# Altium schematic sheet Sheet2.SchDoc
size 300 x 200 mm; SheetNumber: 1; SheetTotal: 2
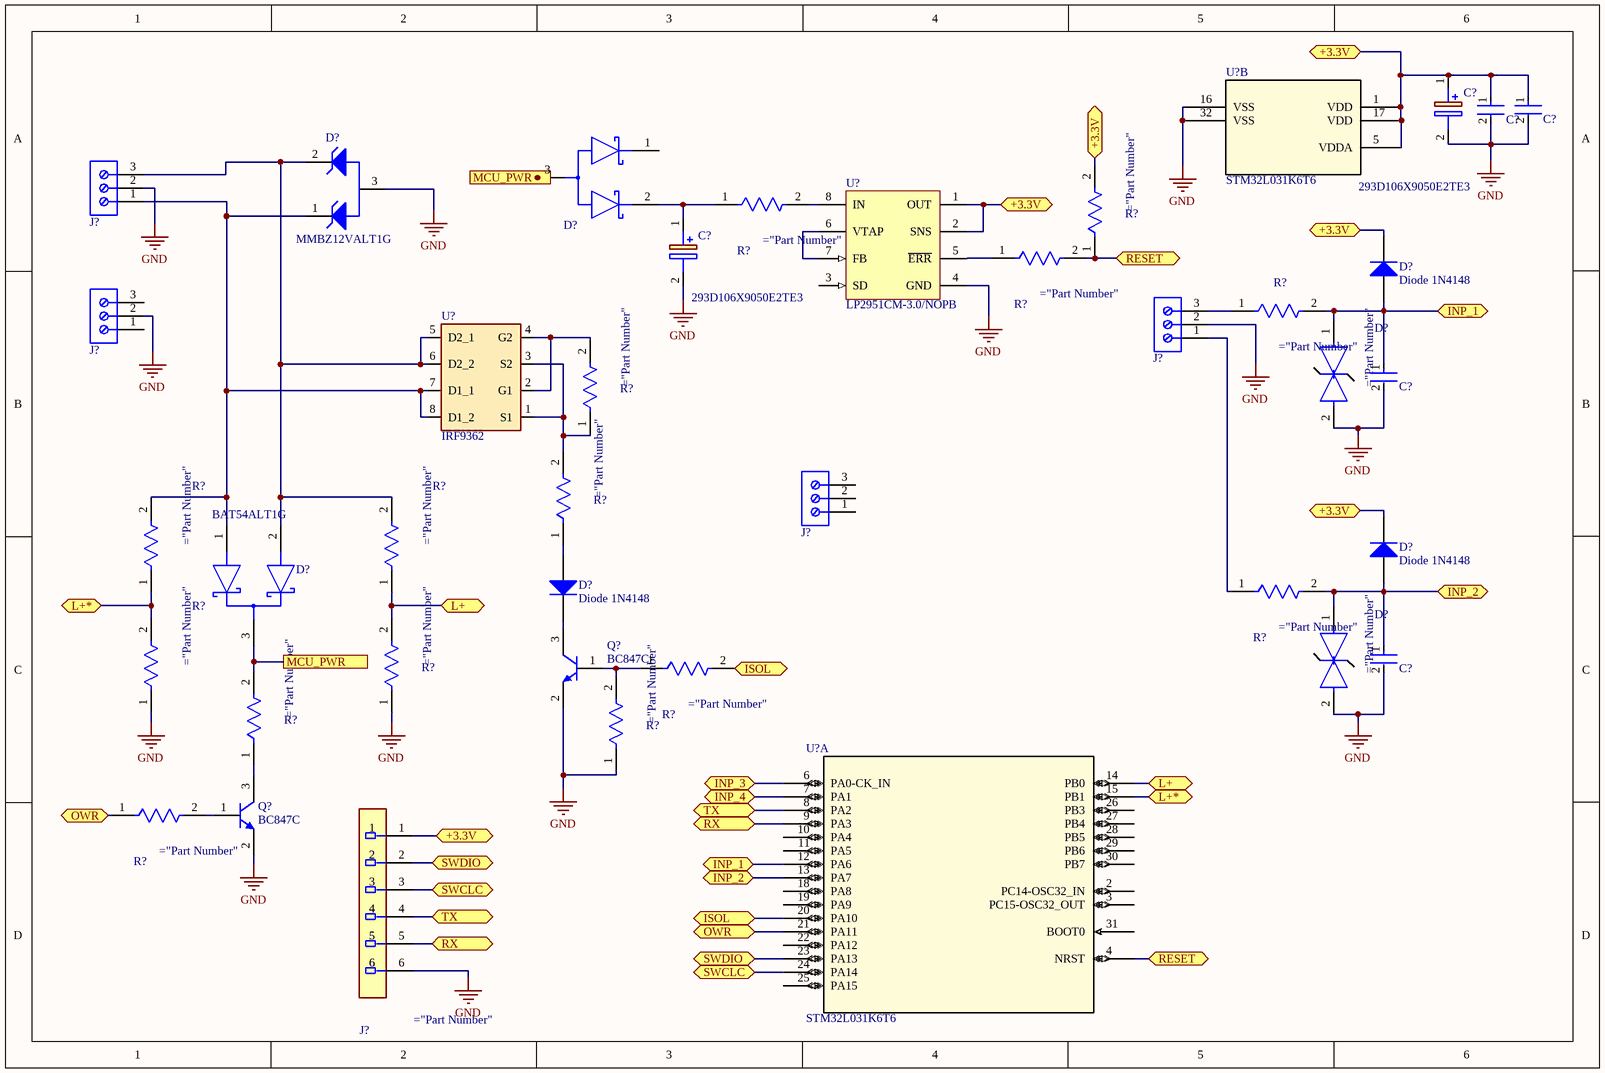
[diagram p0: Sheet2.SchDoc]

## Parts
(Parts that share a designator on the sheet are numbered #1, #2 ... from top to bottom, then left to right.)
C?#1  293D106X9050E2TE3  [CAPPM7343X430N]
C?#2  C0805C224K5RACTU  [KEMET_C0805C-DN_IPC_B]  (value not drawn)
C?#3  C0805C224K5RACTU  [KEMET_C0805C-DN_IPC_B]  (value not drawn)
C?#4  293D106X9050E2TE3  [CAPPM7343X430N]
C?#5  C0805C224K5RACTU  [KEMET_C0805C-DN_IPC_B]  (value not drawn)
C?#6  C0805C224K5RACTU  [KEMET_C0805C-DN_IPC_B]  (value not drawn)
D?#1  BAT54ALT1G  [INF-SOT23_L]  (value not drawn)
D?#2  MMBZ12VALT1G  [ONSC-SOT-23-3-318-08_V]
D?#3  Diode 1N4148  [Vishay_S8-V-3910_01-001_IPC_B]
D?#4  PESD5Z3.3,115  [Nexperia_USA_Inc._SOD523_0]  (value not drawn)
D?#5  Diode 1N4148  [Vishay_S8-V-3910_01-001_IPC_B]
D?#6  Diode 1N4148  [Vishay_S8-V-3910_01-001_IPC_B]
D?#7  BAT54ALT1G  [INF-SOT23_L]
D?#8  PESD5Z3.3,115  [Nexperia_USA_Inc._SOD523_0]  (value not drawn)
J?#1  691103110003  [691103110003]  (value not drawn)
J?#2  691103110003  [691103110003]  (value not drawn)
J?#3  691103110003  [691103110003]  (value not drawn)
J?#4  691103110003  [691103110003]  (value not drawn)
J?#5  SWR25X-NRTC-S06-ST-BA  [Sullins_SWR25X-NRTC-S06-ST-BA_MFG]  (value not drawn)
Q?#1  BC847C  [INF-SOT23_N]
Q?#2  BC847C  [INF-SOT23_N]
R?#1  RC0805FR-07100KL  [6-0805_L]  (value not drawn)
R?#2  RC0805FR-07100KL  [6-0805_N]  (value not drawn)
R?#3  RC0805FR-07100KL  [6-0805_L]  (value not drawn)
R?#4  RC0805FR-07100KL  [6-0805_M]  (value not drawn)
R?#5  RC0805FR-07100KL  [6-0805_N]  (value not drawn)
R?#6  RC0805FR-07100KL  [6-0805_N]  (value not drawn)
R?#7  RC0805FR-07100KL  (value not drawn)
R?#8  RC0805FR-07100KL  (value not drawn)
R?#9  RC0805FR-07100KL  [6-0805_M]  (value not drawn)
R?#10  RC0805FR-07100KL  (value not drawn)
R?#11  RC0805FR-07100KL  (value not drawn)
R?#12  RC0805FR-07100KL  [6-0805_M]  (value not drawn)
R?#13  RC0805FR-07100KL  (value not drawn)
R?#14  RC0805FR-07100KL  [6-0805_N]  (value not drawn)
R?#15  RC0805FR-07100KL  [6-0805_N]  (value not drawn)
U?#1  STM32L031K6T6  [LQFP32_7X7X1P4]  (part B of 2)
U?#2  LP2951CM-3.0/NOPB  [SOIC127P600X175-8N]
U?#3  IRF9362  [M08A_L]
U?#4  STM32L031K6T6  [LQFP32_7X7X1P4]  (part A of 2)

## Ports
+3.3V (bidir), INP_1 (bidir), INP_2 (bidir), INP_3 (bidir), INP_4 (bidir), ISOL (bidir), L+ (bidir), L+* (bidir), MCU_PWR, OWR (bidir), RESET (bidir), RX (bidir), SWCLC (bidir), SWDIO (bidir), TX (bidir)

## Nets
GND: C?#1.2(-) C?#2.2 C?#3.2 C?#4.2(-) C?#5.2 C?#6.2 D?#2.3(A) D?#4.2(A) D?#8.2(A) J?#1.2 J?#2.2 J?#3.2 J?#5.6 Q?#1.2(E) Q?#2.2(E) R?#10.1 R?#11.1 R?#14.1 U?#1.16(VSS) U?#1.32(VSS) U?#2.4(GND)
+3.3V: C?#1.1(+) C?#2.1 C?#3.1 D?#3.2(K) D?#5.2(K) J?#5.1 R?#2.2 U?#1.1(VDD) U?#1.5(VDDA) U?#1.17(VDD) U?#2.1(OUT) U?#2.2(SNS) ; port +3.3V
INP_1: C?#5.1 D?#3.1(A) D?#4.1(C) R?#4.2 U?#4.12(PA6) ; port INP_1
INP_2: C?#6.1 D?#5.1(A) D?#8.1(C) R?#9.2 U?#4.13(PA7) ; port INP_2
INP_3: U?#4.6(PA0-CK_IN) ; port INP_3
INP_4: U?#4.7(PA1) ; port INP_4
ISOL: R?#12.2 U?#4.20(PA10) ; port ISOL
L+: R?#8.1 R?#11.2 U?#4.14(PB0) ; port L+
L+*: R?#7.1 R?#10.2 U?#4.15(PB1) ; port L+*
MCU_PWR: D?#7.3(CATHODE) R?#13.2 ; port MCU_PWR
OWR: R?#15.1 U?#4.21(PA11) ; port OWR
RESET: R?#2.1 R?#3.2 U?#4.4(NRST) ; port RESET
RX: J?#5.5 U?#4.9(PA3) ; port RX
SWCLC: J?#5.3 U?#4.24(PA14) ; port SWCLC
SWDIO: J?#5.2 U?#4.23(PA13) ; port SWDIO
TX: J?#5.4 U?#4.8(PA2) ; port TX
NetC?#4_1: C?#4.1(+) D?#1.2(2_CATHODE) R?#1.1
NetD?#2_1: D?#2.1(K1) D?#7.1(1_ANODE) J?#1.1 R?#7.2 U?#3.7(D1_1) U?#3.8(D1_2)
NetD?#2_2: D?#2.2(K2) D?#7.2(2_ANODE) J?#1.3 R?#8.2 U?#3.5(D2_1) U?#3.6(D2_2)
NetD?#6_1: D?#6.1(A) R?#6.1
NetD?#6_2: D?#6.2(K) Q?#1.3(C)
NetJ?#3_1: J?#3.1 R?#9.1
NetJ?#3_3: J?#3.3 R?#4.1
NetQ?#1_1: Q?#1.1(B) R?#12.1 R?#14.2
NetQ?#2_1: Q?#2.1(B) R?#15.2
NetQ?#2_3: Q?#2.3(C) R?#13.1
NetR?#1_2: R?#1.2 U?#2.8(IN)
NetR?#3_1: R?#3.1 U?#2.5(~{ERR})
NetR?#5_1: R?#5.1 R?#6.2 U?#3.1(S1) U?#3.3(S2)
NetR?#5_2: R?#5.2 U?#3.2(G1) U?#3.4(G2)
NetU?#2_6: U?#2.6(VTAP) U?#2.7(FB)

Not connected (* = marked no-connect by the designer): D?#1 1(1_CATHODE) 3(A); J?#2 1 3; J?#4 1 2 3; U?#2 3(SD); U?#4 2(PC14-OSC32_IN) 3(PC15-OSC32_OUT) 10(PA4) 11(PA5) 18(PA8) 19(PA9) 22(PA12) 25(PA15) 26(PB3) 27(PB4) 28(PB5) 29(PB6) 30(PB7) 31(BOOT0)

## Library data of the parts
C?#1 C?#4 = 293D106X9050E2TE3: Capacitor Polarised; Manufacturer_Name: Vishay; Datasheet Link: http://www.vishay.com/doc?40002; Height: 4.3mm; Manufacturer_Part_Number: 293D106X9050E2TE3; Mouser Part Number: 74-293D106X9050E2TE3; Mouser Price/Stock: https://www.mouser.com/Search/Refine.aspx?Keyword=74-293D106X9050E2TE3; Arrow Part Number: 293D106X9050E2TE3; Arrow Price/Stock: https://www.arrow.com/en/products/293d106x9050e2te3/vishay
D?#2 = MMBZ12VALT1G: 40 W Peak Power Zener Transient Voltage Suppressor, Dual Common Anode Zeners for ESD Protection, 3-Pin SOT-23, Pb-Free, Tape and Reel; Manufacturer: On Semiconductor; V(BR) Typ (V): 12; PPK Max (W): 40; Direction: Unidirectional; IR Max (uA): 0.2; ComponentLink1Description: Manufacturer URL; ComponentLink2Description: Datasheet; ComponentLink3Description: Package Specification; ComponentLink3URL: http://www.onsemi.cn/pub_link/Collateral/318-08.PDF; DatasheetVersion: Rev. 13; ComponentLink1URL: http://www.onsemi.com/; PartNumber: MMBZ12VALT1G; ComponentLink2URL: http://www.onsemi.com/pub_link/Collateral/MMBZ5V6ALT1-D.PDF; Packing: Tape and Reel; Mounting Technology: Surface Mount; PackageDescription: 3-Pin Small Outline Transistor, Body 2.92 x 1.3 mm, Pitch 0.95 mm; PackageVersion: Rev. AP, 11/2009; RoHS: Pb-Free; PackageReference: SOT-23-3-318-08
D?#3 D?#5 D?#6 = Diode 1N4148: High Conductance Fast Diode; Published: 8-Jun-2000; LatestRevisionDate: 17-Jul-2002; LatestRevisionNote: Re-released for DXP Platform.; DatasheetVersion: 1997; PackageReference: DO-35; Publisher: Altium Limited; PackageDescription: Diode, Axial; Body 3.8 x 1.9 mm (LxDia. max), Lead Dia. 0.53 mm (max); Code_JEDEC: DO-204-AH; ComponentLink1Description: Manufacturer Link; ComponentLink1URL: http://www.fairchildsemi.com/; ComponentLink2Description: Datasheet; ComponentLink2URL: http://www.fairchildsemi.com/ds/1N%2F1N4148.pdf
J?#1-J?#4 = 691103110003: WR-TBL Series 1031 Horizontal Entry Modular, Through Hole, pitch 3.5mm, 3p; Manufacturer: Wurth Elektronik; Pin Number: 3; Rated Current: 10A; Working Voltage: 125V; PCB/Cable/Panel: PCB; Modularity: Yes; ComponentLink1Description: Manufacturer Link; ComponentLink1URL: https://www.we-online.com/redexpert/article/691103110003?ad; ComponentLink2Description: Datasheet; ComponentLink2URL: https://www.we-online.com/redexpert/spec/691103110003?ad; Category: Terminal Blocks; Match Code: WR-TBL; Manufacturer Part Number: 691103110003; Mount: Through Hole; Operating Temperature Max: 105°C; Operating Temperature Min: -40°C; Packaging: Box; Pitch: 3.5mm; Orientation: Horizontal; Application: Pressure Clamp
Q?#1 Q?#2 = BC847C: NPN Silicon AF Transistor, 45 V VCEO, 100 mA IC, SOT23, Reel, Green; Manufacturer: Infineon; Ptot (max): 330Â mW; VEBO (max): 6Â V; IBM (max): 200Â mA; VCBO (max): 50Â V; Green: TRUE; fT (typ): 250Â MHz; VCEO (max): 45Â V; IC (max): 100Â mA; ICBO (max): 15Â nA; Polarity: NPN; PartNumber: BC847C; PackageVersion: Apr-08; ComponentLink1Description: Manufacturer URL; ComponentLink2Description: Datasheet; ComponentLink3URL: http://www.infineon.com/dgdl/SOT23-Package_Overview.pdf?folderId=db3a30431936bc4b0119532290053c66&fileId=db3a30431936bc4b0119533468123c85; ComponentLink3Description: Package Specification; ComponentLink1URL: http://www.infineon.com/; Packing: Reel; ComponentLink2URL: http://www.infineon.com/dgdl/bc847series_bc848series_bc849series_bc850series.pdf?folderId=db3a304314dca389011541d30fa21656&fileId=db3a304314dca389011541d4630a1657; ICM (max): 200Â mA; Mounting Technology: Surface Mount; PackageReference: SOT23; PackageDescription: 3-Pin Small Outline Transistor Package, 1.3 x 2.9 mm Body, 0.95 mm Pitch
U?#1 U?#4 = STM32L031K6T6: No Description Available; Mfr_Name: STMicroelectronics; Copyright: Copyright (C) 2022 Ultra Librarian. All rights reserved.; Manufacturer_Part_Number: STM32L031K6T6; RefDes: RefDes; Type: DEV
U?#2 = LP2951CM-3.0/NOPB: Series of Adjustable Micropower Voltage Regulators, 8-pin Narrow SOIC, Pb-Free; Manufacturer: National Semiconductor; PackageTopMarking: NSZXTT*2951C*M30DD; PowerWise: N; CompType: LDO IC; PinCount: 8; DatasheetVersion: Jun-2009; Code_JEDEC: MS-012-AA; Code_IPC: SOIC127P600-8; PackageVersion: revM, May-2009; PackageDescription: SOIC Narrow, 4.9 x 3.9 x 1.45mm, 8 Lead, 1.27mm Pitch; RoHS: Y; PackageReference: M08A; PartNumber: LP2951CM-3.0/NOPB